# EAGLE design bbtc-relays (EAGLE 6.5.0)
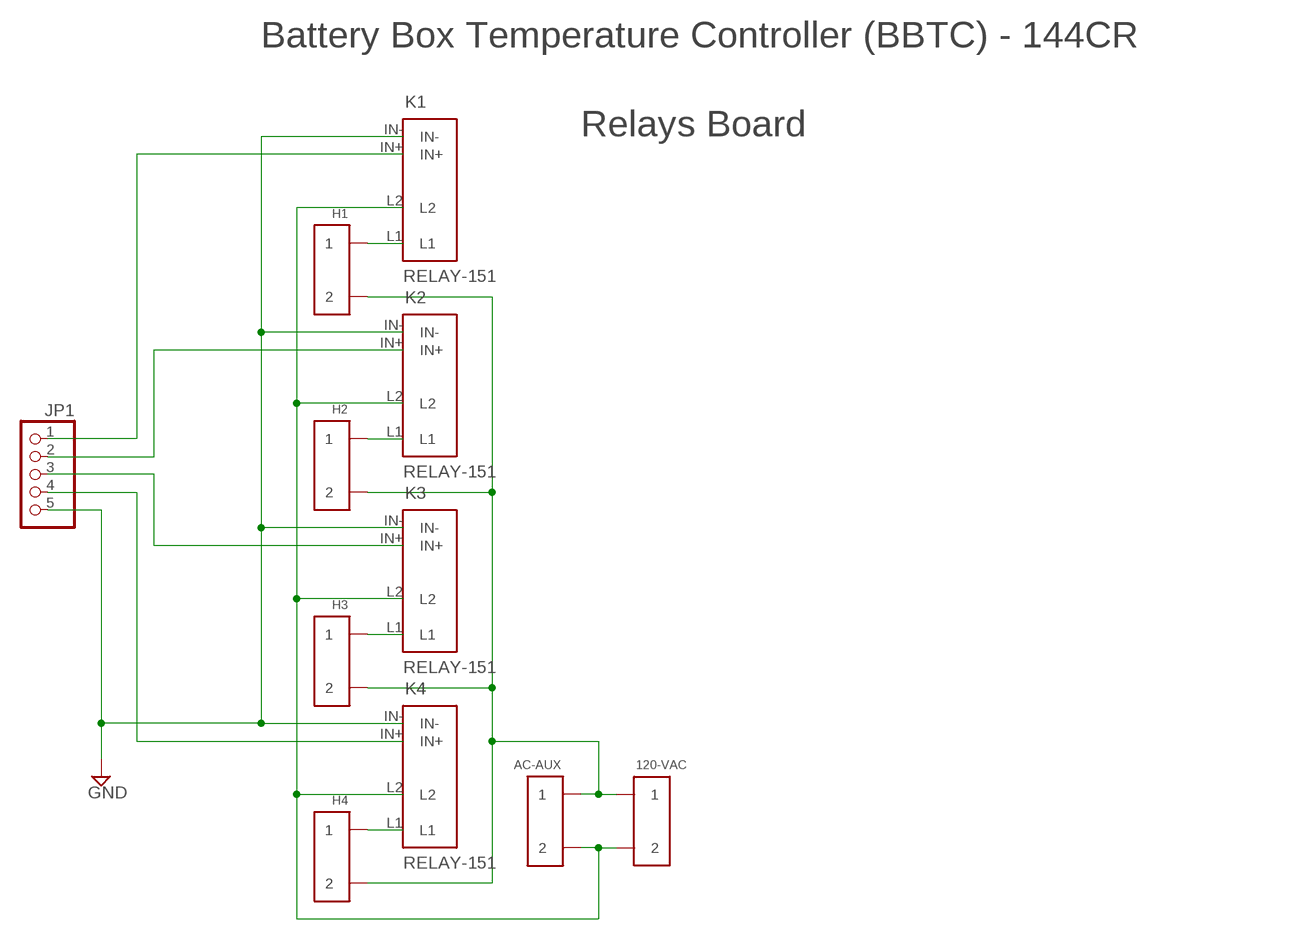
[diagram p0: schematic, sheet 1]

## Parts
120-VAC  SCREW-CLAMP-906  [SCREW-CLAMP-906]
AC-AUX  SCREW-CLAMP-909  [SCREW-CLAMP-909]
H1  SCREW-CLAMP-906  [SCREW-CLAMP-906]
H2  SCREW-CLAMP-906  [SCREW-CLAMP-906]
H3  SCREW-CLAMP-906  [SCREW-CLAMP-906]
H4  SCREW-CLAMP-906  [SCREW-CLAMP-906]
JP1  PINHD-1X5  [1X05]
K1  RELAY-151  [RELAY-151]
K2  RELAY-151  [RELAY-151]
K3  RELAY-151  [RELAY-151]
K4  RELAY-151  [RELAY-151]

## Nets
GND: JP1.5 K1.IN- K2.IN- K3.IN- K4.IN-
L1: 120-VAC.1 AC-AUX.1 H1.2 H2.2 H3.2 H4.2
L2: 120-VAC.2 AC-AUX.2 K1.L2 K2.L2 K3.L2 K4.L2
N$1: H4.1 K4.L1
N$3: H3.1 K3.L1
N$4: JP1.1 K1.IN+
N$5: H2.1 K2.L1
N$6: H1.1 K1.L1
N$7: JP1.2 K2.IN+
N$8: JP1.3 K3.IN+
N$9: JP1.4 K4.IN+

## Notes on the sheet
- Battery Box Temperature Controller (BBTC) - 144CR
- Relays Board

## Library data of the parts
120-VAC H1-H4 = trl:SCREW-CLAMP-906
AC-AUX = trl:SCREW-CLAMP-909
JP1 = pinhead:PINHD-1X5: PIN HEADER
K1-K4 = trl:RELAY-151

## Board
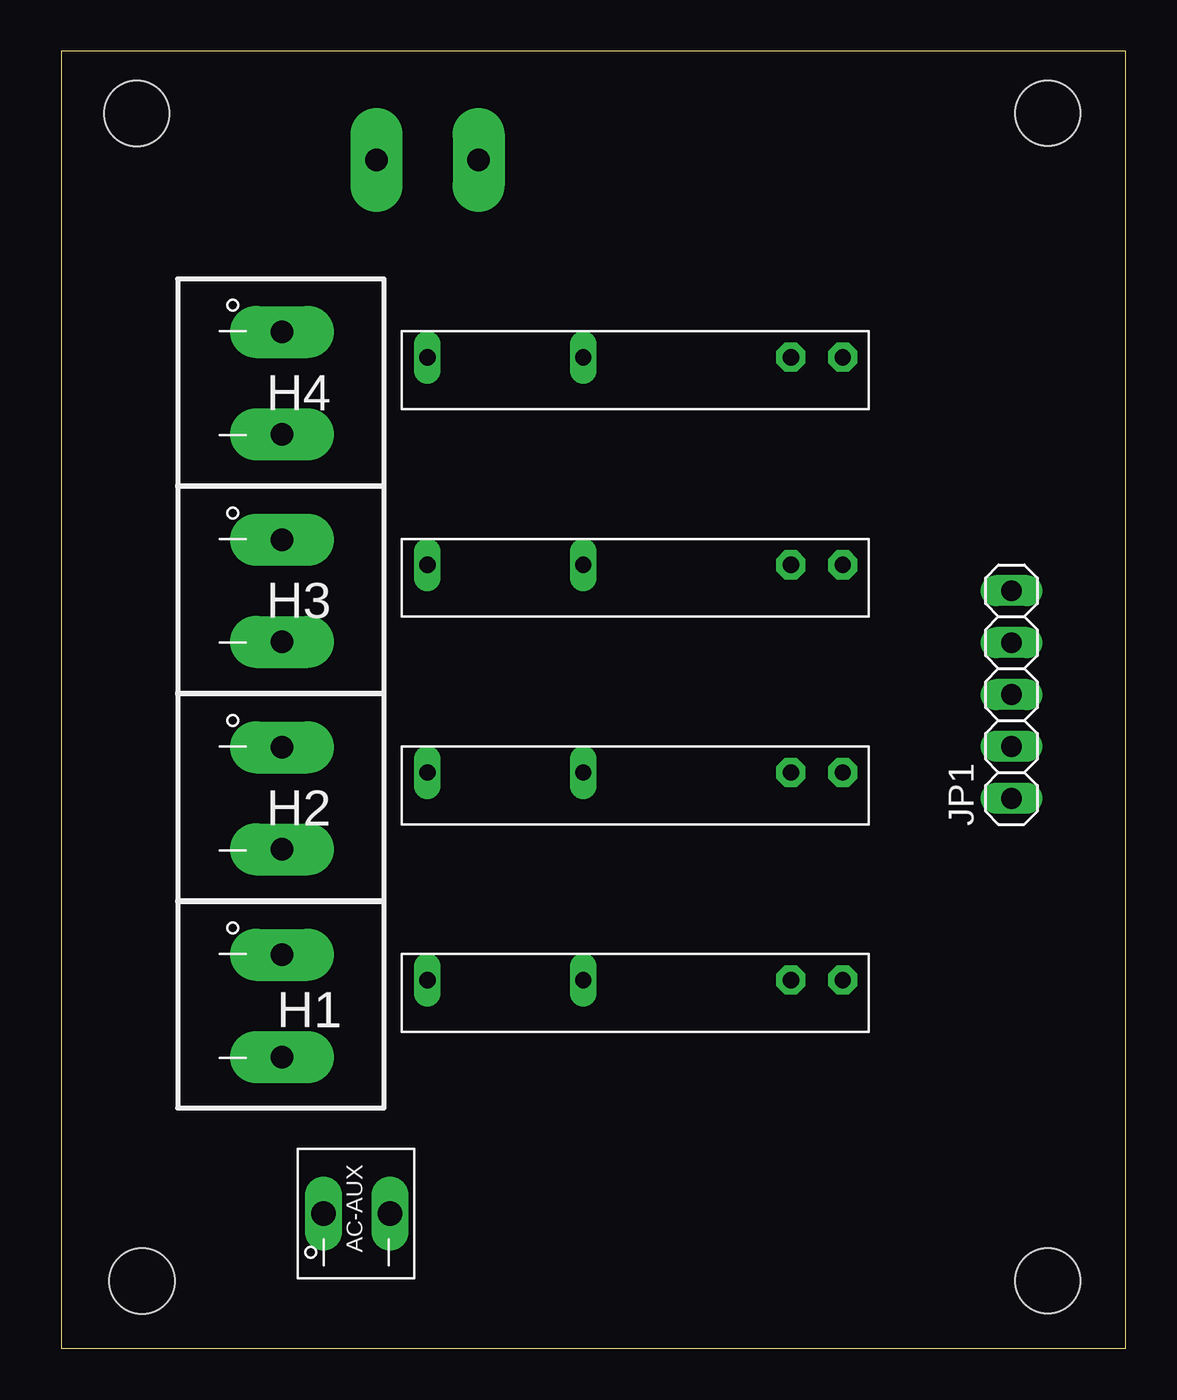
[diagram p1: board, top side]
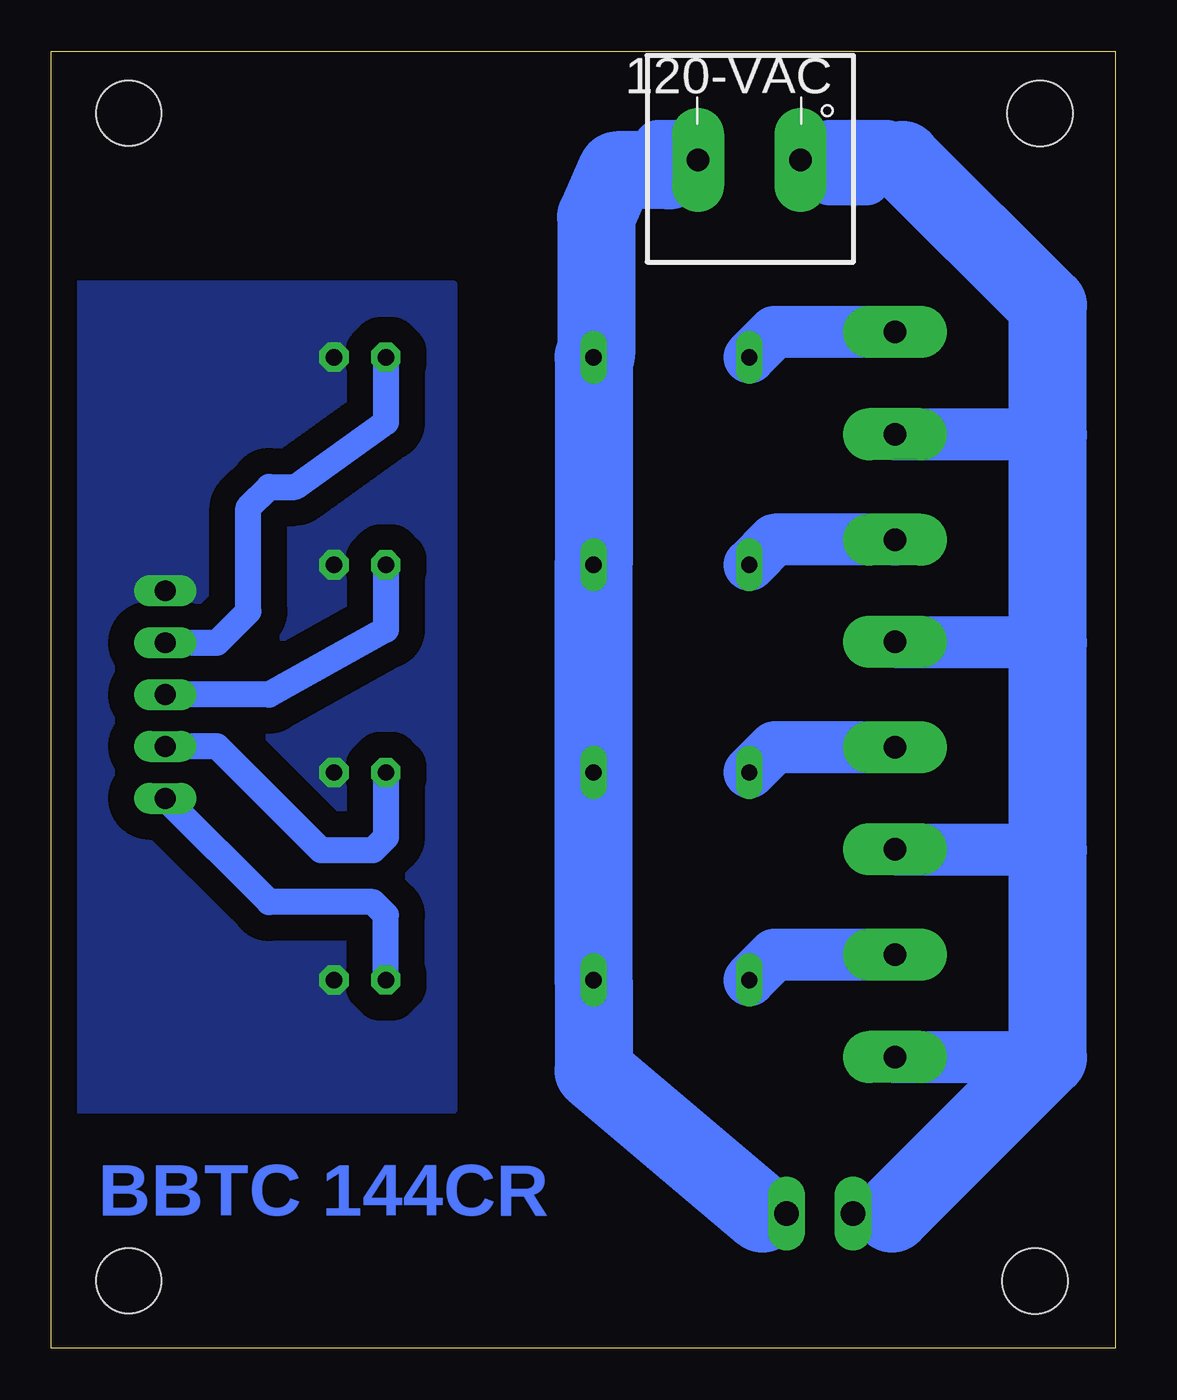
[diagram p2: board, bottom side, seen from below]

Size 52.07 x 63.5 mm. Coordinates in mm from the lower left corner, seen from the top.
Outline: 0,0 52.07,0 52.07,63.5 0,63.5 0,0
Copper layers (1*16): Top 0.035mm / dielectric 1.5mm / Bottom 0.035mm
Design rules "default": minimum track width 10mil, minimum drill 24mil, track to track 8mil, track to pad 8mil, pad to pad 8mil, via to via 8mil, smd to smd 8mil, copper to edge 40mil, drill to drill 8mil, minimum pad ring 10mil, minimum via ring 8mil, stop-mask expansion 4mil, vias tented up to drill 0mil, thermal gap 10mil
Holes 3.2 mm at 3.68,60.45 3.94,3.3
Holes 3.17 mm at 48.26,60.45 48.26,3.3

### Footprints (pad centres in the part's own frame; a part is rotated, then mirrored left to right if it is on the bottom)
SCREW-CLAMP-906 = drill 1.1 pad 2.54 long: 1 -2.5,0.5; 2 2.5,0.5
SCREW-CLAMP-909 = drill 1.2 long: 1 0,0; 2 3.251,0
1X05 = drill 1.016 long: 1 -5.08,0; 2 -2.54,0; 3 0,0; 4 2.54,0; 5 5.08,0
RELAY-151 = drill 0.8 pad 1.422 octagon: IN+ -6.35,0; IN- -8.89,0 | drill 0.8 long: L1 11.43,0; L2 3.81,0

### Placement (x,y rotation side)
120-VAC  17.91,58.67 180 bottom
AC-AUX  12.83,6.6 0 top
H1  10.29,16.76 270 top
H2  10.29,26.92 270 top
H3  10.29,37.08 270 top
H4  10.29,47.24 270 top
JP1  46.48,32 90 top
K1  29.34,18.03 180 top
K2  29.34,28.19 180 top
K3  29.34,38.35 180 top
K4  29.34,48.51 180 top

### Tracks (layer width: path | path; a pad name or v marks a point on that pad's centre or on a via)
GND
  pour Bottom (isolate 1.27, no thermals): 32.38,52.07 53.34,52.07 53.34,11.7 32.38,11.68
L1
  Bottom 0.813: 3.34,44.74 3.3,44.7 | 3.34,34.58 3.3,34.54 | 3.34,24.42 3.3,24.38 | 3.34,14.26 3.3,14.22
  Bottom 1.778: AC-AUX.1 10.92,6.6
  Bottom 2.413: 120-VAC.1 14.72,58.17 13.97,58.93 13.97,57.15 12.19,57.15 12.19,57.4 13.72,58.93 11.18,58.93 10.41,58.17
  Bottom 2.54: H4.2 3.34,44.74 | H3.2 3.34,34.58 | H2.2 3.34,24.42 | H1.2 3.34,14.26
  Bottom 3.81: 10.41,58.17 3.3,51.05 3.3,44.7 3.3,34.54 3.3,24.38 3.3,14.22 10.92,6.6
L2
  Bottom 1.778: 17.27,6.6 AC-AUX.2
  Bottom 2.413: 120-VAC.2 20.41,58.93 22.35,58.93 21.84,57.66
  Bottom 3.81: 17.27,6.6 25.53,13.59 K1.L2 K2.L2 K3.L2 K4.L2 25.4,48.64 25.4,55.37 24.38,57.66 21.84,57.66
N$1
  Bottom 2.54: H4.1 16.68,49.74 K4.L1
N$3
  Bottom 2.54: H3.1 16.68,39.58 K3.L1
N$4
  Bottom 1.27: JP1.1 41.4,21.84 36.32,21.84 35.69,21.21 K1.IN+
N$5
  Bottom 2.54: H2.1 16.68,29.42 K2.L1
N$6
  Bottom 2.54: H1.1 16.68,19.26 K1.L1
N$7
  Bottom 1.27: K2.IN+ 35.69,25.02 36.32,24.38 38.86,24.38 43.94,29.46 JP1.2
N$8
  Bottom 1.27: K3.IN+ 35.69,35.18 41.4,32 JP1.3
N$9
  Bottom 1.27: K4.IN+ 35.69,45.34 40.13,42.16 41.4,42.16 42.42,41.15 42.42,36.07 43.94,34.54 JP1.4

### Text on the board
Bottom: BBTC 144CR